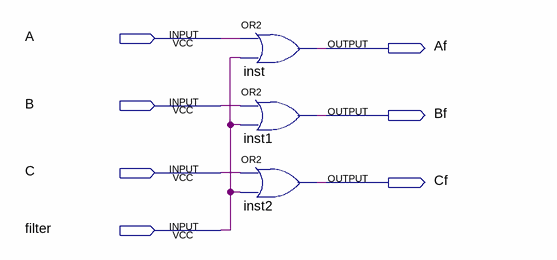
[diagram p0: schematic sheet]
// Quartus schematic OR_map3.bdf as structural Verilog: 3 symbols, 7 pins
module OR_map3 (
  input  A,
  input  B,
  input  C,
  input  filter,
  output Af,
  output Bf,
  output Cf
);

  or inst (Af, A, filter);
  or inst1 (Bf, B, filter);
  or inst2 (Cf, C, filter);
endmodule
